# EAGLE schematic JouleThiefLamp (EAGLE 6.5.0)
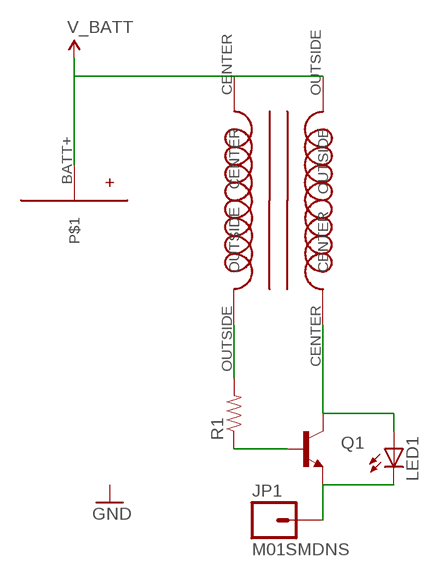
[diagram p0: schematic, sheet 1]

## Parts
JP1  M01SMDNS  [1X01NS]
LED1  LED5MM  [LED5MM]
Q1  TRANSISTOR_NPNTO-92-AMMO  [TO-92-AMMO]
R1  RESISTORPTH-1/4W-VERT  [AXIAL-0.1]
U$1  AA+BATT  [AA+]
U$2  HALF_CHOKE  [HALF_CHOKE]
U$3  HALF_CHOKE  [HALF_CHOKE]

## Nets
-: JP1.1 LED1.K(C) Q1.1(E)
N$1: R1.P$2 U$3.OUTSIDE
N$3: LED1.A Q1.3(C) U$3.CENTER
N$5: Q1.2(B) R1.P$1
V_BATT: U$1.BATT+ U$2.CENTER U$2.OUTSIDE

## Library data of the parts
JP1 = SparkFun-Connectors:M01: Header 1 Standard 1-pin 0.1" header. Use with straight break away headers (SKU : PRT-00116), right angle break away headers (PRT-00553), swiss pins (PRT-00743), machine pins (PRT-00117), and female headers (PRT-00115).
LED1 = SparkFun-LED:LED: LEDs Standard schematic elements and footprints for 5mm, 3mm, 1206, and 0603 sized LEDs. 5mm - Spark Fun Electronics SKU : COM-00529 (and others)
Q1 = SparkFun-DiscreteSemi:TRANSISTOR_NPN: Generic NPN BJT MMBT2222A - TRANS-08049 (SOT-23, 1A 40V) MPSA42 - TRANS-09116 (SOT-23, 500mA 300V) MMBT5088LT1G - TRANS-11160 (SOT-23, 50 mA 30V) BC547 - COM-08928 <http://www.sparkfun.com/products/8928> (TO-92 45V 100mA) (1.Collector 2.Base 3.Emitter) 2N3904 - COM-00521 <http://www.sparkfun.com/products/521> (TO-92 40V 200mA) (1.Emitter 2.Base 3.Collector) P2N2222A - COM-12852 <http://www.sparkfun.com/products/12852> (TO-92 40V 600mA) (1.Collector 2.Base 3.Emitter)
R1 = SparkFun-Resistors:RESISTOR: Resistor Basic schematic elements and footprints for 0603, 1206, and PTH resistors.
U$1 = barbary_enterprises:AA+
U$2 U$3 = barbary_enterprises:HALF_CHOKE